# Altium schematic sheet Demo Board 1 - Schematic.SchDoc
size A4; SheetNumber: 1; SheetTotal: 4
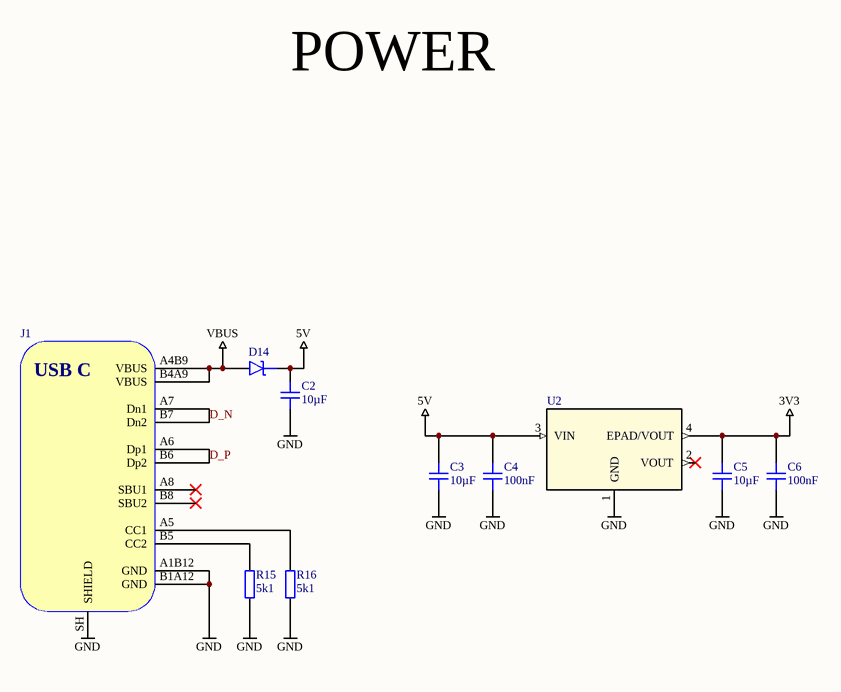
[diagram p0: Demo Board 1 - Schematic.SchDoc]

## Parts
C2  10µF  [CAP_0805]
C3  10µF  [CAP_0805]
C4  100nF  [CAP_0603]
C5  10µF  [CAP_0805]
C6  100nF  [CAP_0603]
D14  MS2A40LWS  [SOD-323]  (value not drawn)
J1  USB4105-GF-A-060  [USB4105-GF-A-060]  (value not drawn)
R15  5k1  [RES_0402]
R16  5k1  [RES_0402]
U2  AMS1117-3.3  [SOT_AMS_ADS]  (value not drawn)

## Nets
3V3: C5.2 C6.2 U2.4(EPAD/VOUT)
5V: C2.2 C3.2 C4.2 D14.K U2.3(VIN)
GND: C2.1 C3.1 C4.1 C5.1 C6.1 J1.A1B12(GND) J1.B1A12(GND) J1.SH(SHIELD) R15.1 R16.1 U2.1(GND)
VBUS: D14.A J1.A4B9(VBUS) J1.B4A9(VBUS)
D_N: J1.A7(Dn1) J1.B7(Dn2)
D_P: J1.A6(Dp1) J1.B6(Dp2)
NetJ1_A5: J1.A5(CC1) R16.2
NetJ1_B5: J1.B5(CC2) R15.2

Not connected (* = marked no-connect by the designer): J1 A8(SBU1)* B8(SBU2)*; U2 2(VOUT)*

## Notes on the sheet
- POWER
- (near J1) USB-C
- (in symbol USB4105-GF-A-060) USB C

## Library data of the parts
C2 C3 C5 = CAP_0805: Capacitor SMD 0805; Manufacturer: *; Manufacturer Part Number: *; Distributor Link: *; LCSC: *; Rating: *; Dielectric: *
C4 C6 = CAP_0603: Capacitor SMD 0603; Manufacturer: *; Manufacturer Part Number: *; Distributor Link: *; LCSC: *; Rating: *; Dielectric: *
D14 = D_SCHOTTKY_SOD_323: Diode Schottky SMD SOD-323, MS2A40LWS
J1 = USB4105-GF-A-060: USB Connector Type C SMT 12 Pin; Manufacturer: GCT; Manufacturer Part Number: USB4105-GF-A-060; Distributor Link: https://eu.mouser.com/ProductDetail/GCT/USB4105-GF-A-060?qs=QNEnbhJQKvY2mocwNJzgfA%3D%3D
R15 R16 = RES_0402: Resistor SMD 0402; Manufacturer: *; Manufacturer Part Number: *; Distributor Link: *; LCSC: *
U2 = AMS1117-3.3: Description; Manufacturer_Name: Advanced Monolithic Systems; Copyright: Copyright (C) 2025 Ultra Librarian. All rights reserved.; Manufacturer_Part_Number: AMS1117-3.3; RefDes: RefDes; Type: Type